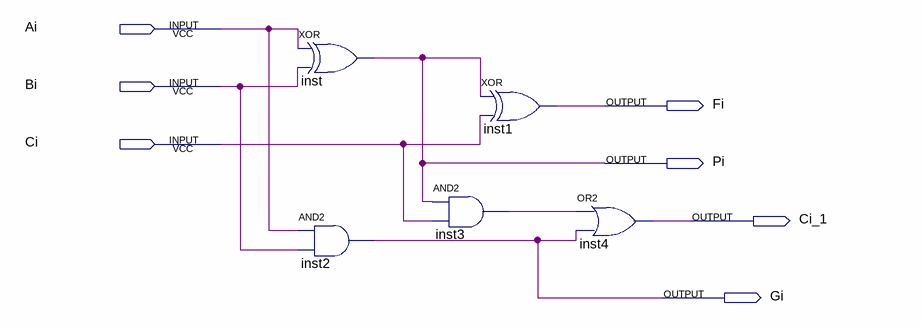
[diagram p0: schematic sheet]
// Quartus schematic add1.bdf as structural Verilog: 5 symbols, 7 pins
module add1 (
  input  Ai,
  input  Bi,
  input  Ci,
  output Fi,
  output Pi,
  output Ci_1,
  output Gi
);

  wire inst3_out;

  xor inst (Pi, Ai, Bi);
  and inst2 (Gi, Ai, Bi);
  and inst3 (inst3_out, Pi, Ci);
  xor inst1 (Fi, Pi, Ci);
  or inst4 (Ci_1, inst3_out, Gi);
endmodule
